# EAGLE design lazurite_ble_cs75 (EAGLE 7.6.0)
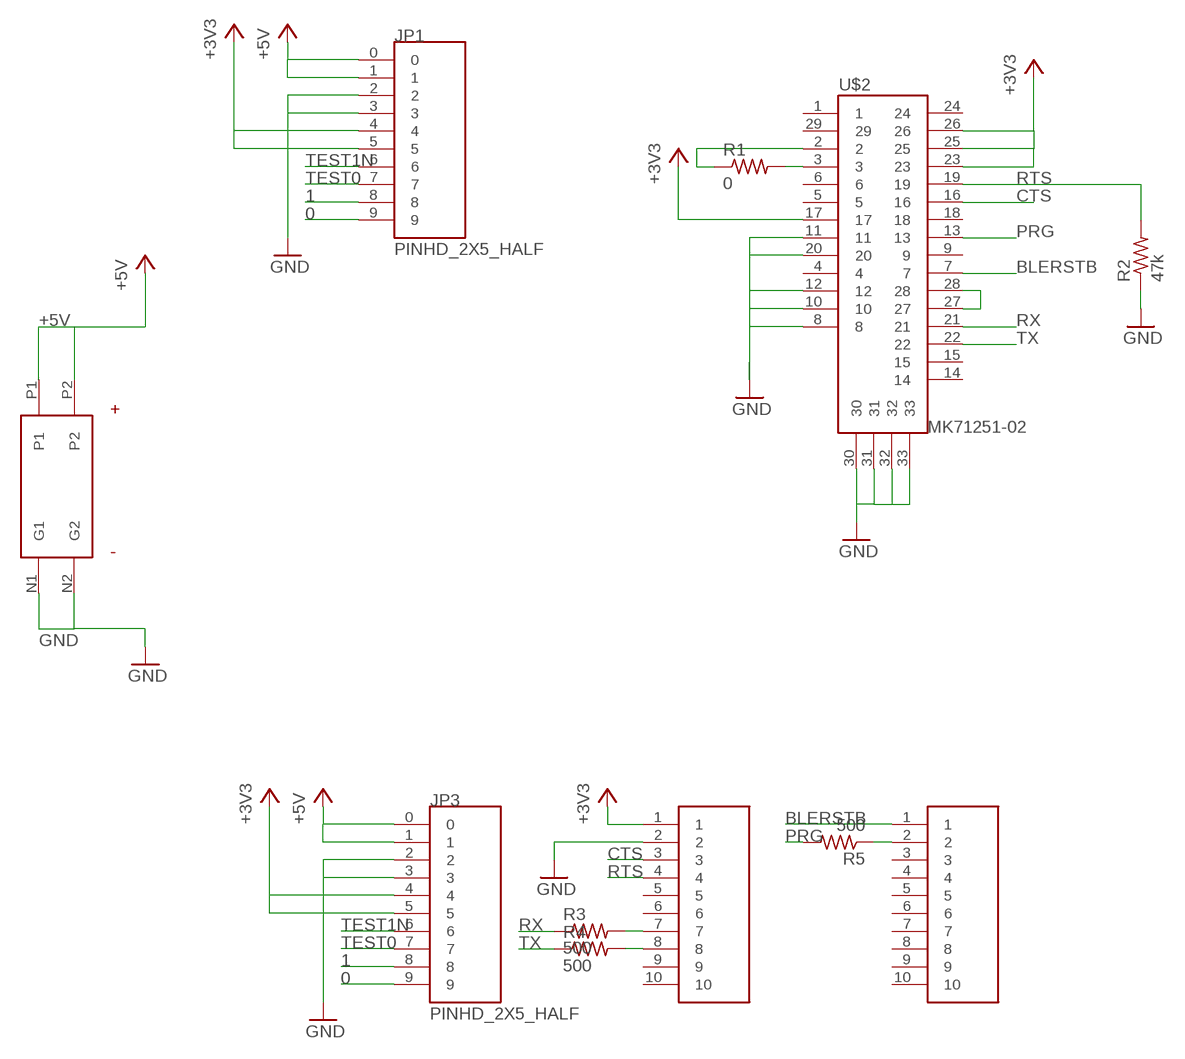
[diagram p0: schematic, sheet 1]

## Parts
JP1  PINHD_2X5_HALF  [PINHD_2X5_HALF]
JP3  PINHD_2X5_HALF  [PINHD_2X5_HALF]
R1  0  R-US_R0402  [R0402]
R2  47k  R-US_R0402  [R0402]
R3  500  R-US_R0402  [R0402]
R4  500  R-US_R0402  [R0402]
R5  500  R-US_R0402  [R0402]
U$1  TAKACHI_CS75_BATTERY  [TAKACHI_CS75_BATTERY]
U$2  MK71251-02  [MK71251-02]
U$3  PINHD_1_10_HALF  [PINHD_1X10_HALF]
U$4  PINHD_1_10_HALF  [PINHD_1X10_HALF]

## Nets
0: JP1.9 JP3.9
1: JP1.8 JP3.8
+3V3: JP1.4 JP1.5 JP3.4 JP3.5 U$2.17 U$2.23 U$2.25 U$2.26 U$3.1
+5V: JP1.0 JP1.1 JP3.0 JP3.1 U$1.P1 U$1.P2
BLERSTB: U$2.7 U$4.1
CTS: U$2.16 U$3.3
GND: JP1.2 JP1.3 JP3.2 JP3.3 R2.1 U$1.N1(G1) U$1.N2(G2) U$2.8 U$2.10 U$2.11 U$2.12 U$2.20 U$2.30 U$2.31 U$2.32 U$2.33 U$3.2
N$1: R1.2 U$2.3
N$2: R1.1 U$2.2
N$4: U$2.27 U$2.28
N$7: R5.1 U$4.2
N$9: R4.2 U$3.8
N$10: R3.2 U$3.7
PRG: R5.2 U$2.13
RTS: R2.2 U$2.19 U$3.4
RX: R3.1 U$2.21
TEST0: JP1.7 JP3.7
TEST1N: JP1.6 JP3.6
TX: R4.1 U$2.22
Unconnected: U$2.1 U$2.4 U$2.5 U$2.6 U$2.9 U$2.14 U$2.15 U$2.18 U$2.24 U$2.29 U$3.5 U$3.6 U$3.9 U$3.10 U$4.3 U$4.4 U$4.5 U$4.6 U$4.7 U$4.8 U$4.9 U$4.10

## Library data of the parts
JP1 JP3 = lazurite:PINHD_2X5_HALF
R1-R5 = rcl:R-US_: RESISTOR, American symbol
U$1 = lz-shield:TAKACHI_CS75_BATTERY
U$2 = lz-shield:MK71251-02
U$3 U$4 = lazurite:PINHD_1_10_HALF

## Board
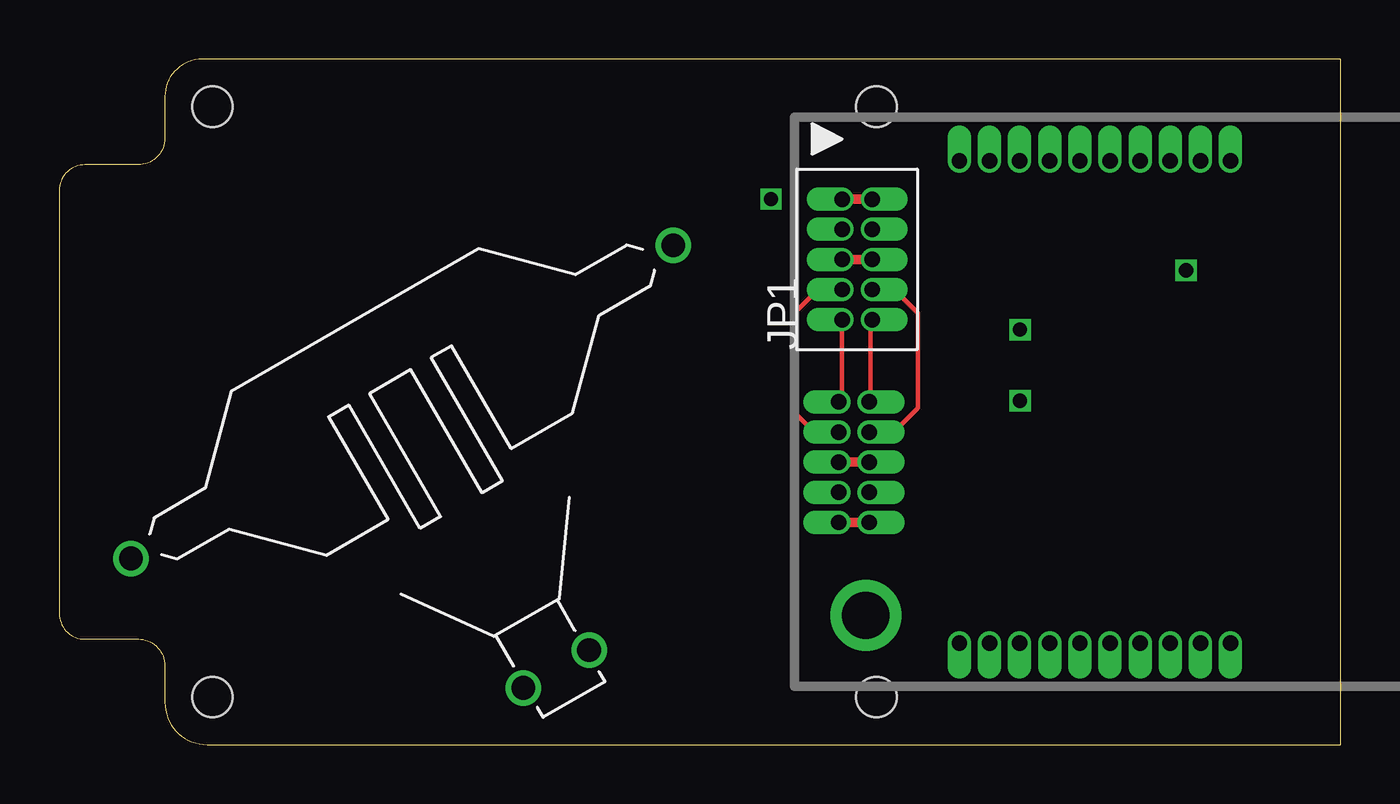
[diagram p1: board, top side]
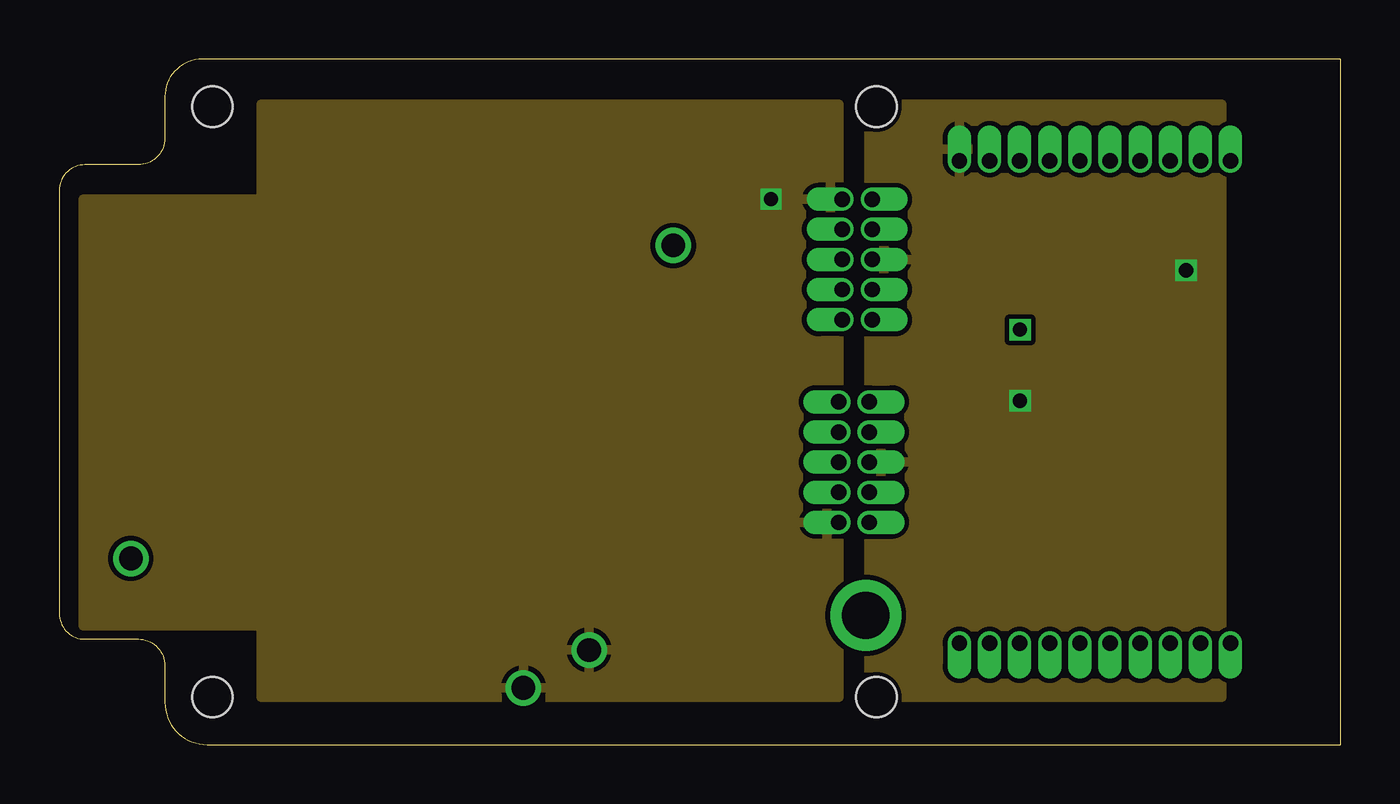
[diagram p2: board, inner layer Route2]
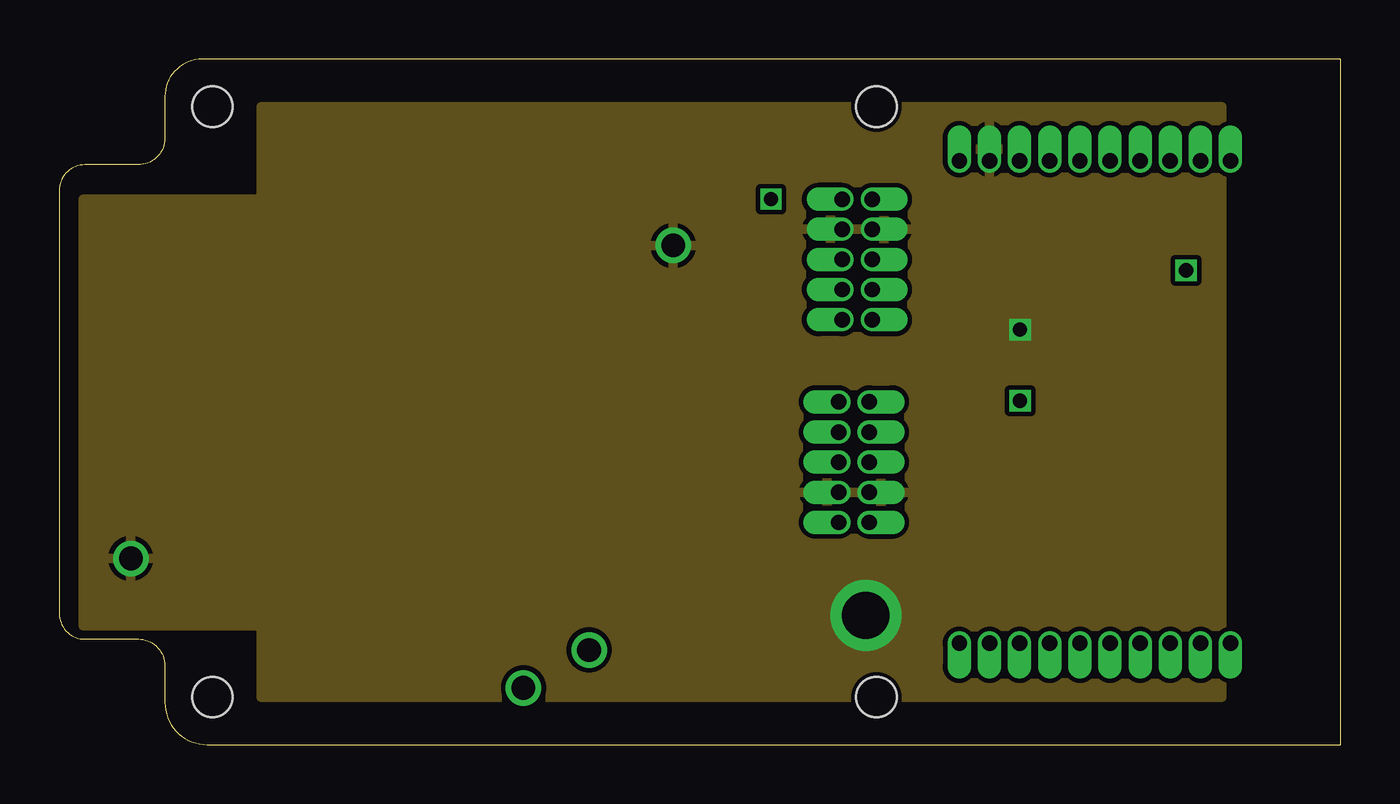
[diagram p3: board, inner layer Route3]
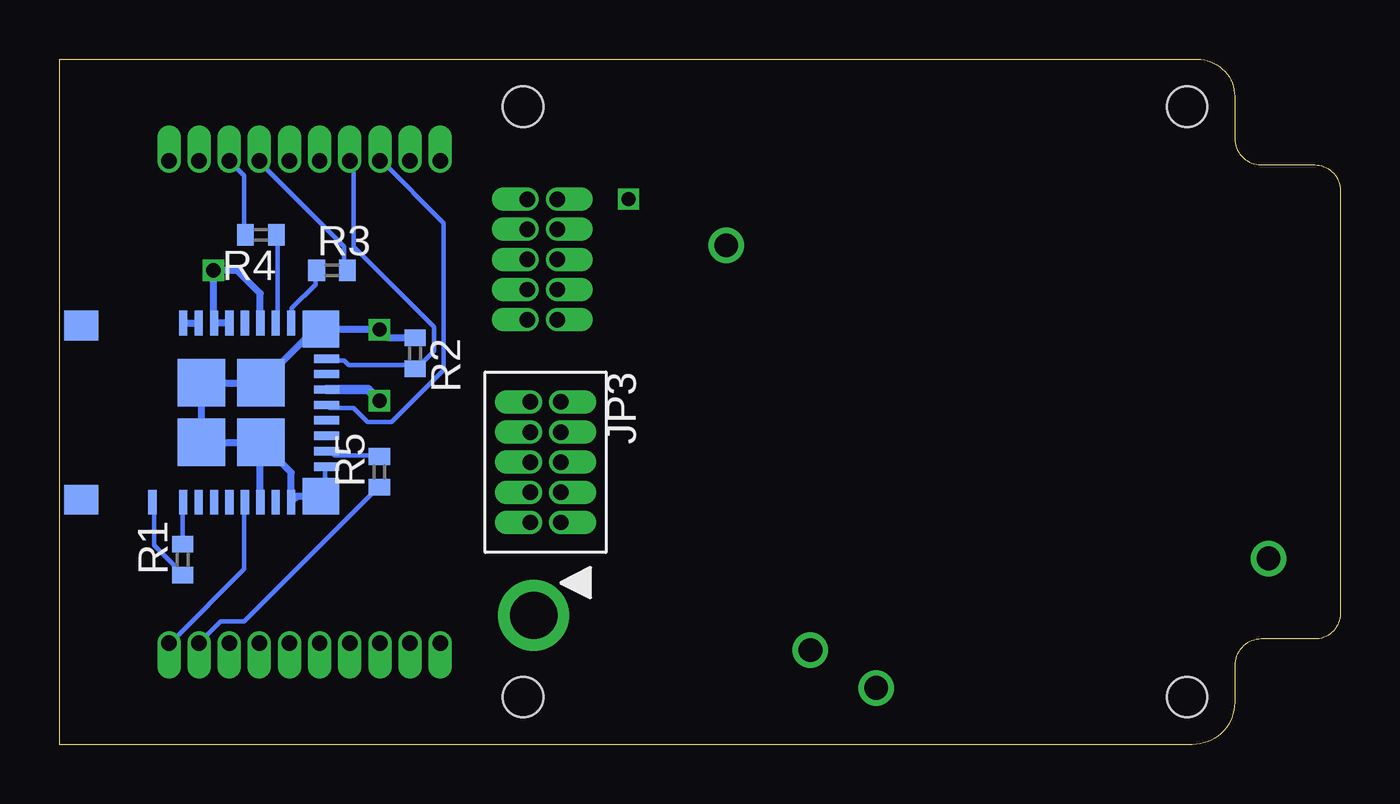
[diagram p4: board, bottom side, seen from below]

Size 54 x 28.9 mm. Coordinates in mm from the lower left corner, seen from the top.
Outline: 4.45,3.33 4.45,1.78 arc90 6.23,0 54,0 54,28.9 6.02,28.9 arc90 4.45,27.33 4.45,25.57 arc-90 3.33,24.45 1.07,24.45 arc90 0,23.38 0,5.52 arc90 1.07,4.45 3.33,4.45 arc-90 4.45,3.33
Copper layers (1+2*3+16): Top 0.018mm / dielectric 0.36mm / Route2 0.035mm / dielectric 0.71mm / Route3 0.035mm / dielectric 0.36mm / Bottom 0.018mm
Design rules "eC_4Layer_PClass6_BaseCopperO18-I35_eCDefault *": minimum track width 0.2mm, minimum drill 0.35mm, track to track 0.2mm, track to pad 0.2mm, pad to pad 0.2mm, via to via 0.2mm, smd to smd 0mil, copper to edge 0.2mm, drill to drill 0.3mm, minimum pad ring 0.175mm, minimum via ring 0.125mm, stop-mask expansion 0mil, vias tented up to drill 0.45mm, thermal gap 0.2mm
Holes 1.7 mm at 34.45,26.9 6.45,26.9 6.45,2 34.45,2

### Footprints (pad centres in the part's own frame; a part is rotated, then mirrored left to right if it is on the bottom)
PINHD_2X5_HALF = drill 0.65 pad 0.813 offset: 0 0,0; 1 0,-1.27; 2 -1.27,0; 3 -1.27,-1.27; 4 -2.54,0; 5 -2.54,-1.27; 6 -3.81,0; 7 -3.81,-1.27; 8 -5.08,0; 9 -5.08,-1.27
R0402 = smd 0.7 x 0.9: 1 -0.65,0; 2 0.65,0
TAKACHI_CS75_BATTERY = drill 1: N1 -13.2,0; N2 13.2,0; P1 -1.6,13; P2 1.6,13
MK71251-02 = smd 1.25 x 1.45: 1 -3.675,5.075; 29 3.675,5.075 | smd 1.05 x 0.35: 2 -3.775,2.075; 3 -3.775,0.775; 4 -3.775,0.125; 5 -3.775,-0.525; 6 -3.775,-1.175; 7 -3.775,-1.825; 8 -3.775,-2.475; 9 -3.775,-3.125; 10 -3.775,-3.775; 21 3.775,-3.775; 22 3.775,-3.125; 23 3.775,-2.475; 24 3.775,-1.825; 25 3.775,-1.175; 26 3.775,-0.525; 27 3.775,0.125; 28 3.775,0.775 | smd 1.55 x 1.55: 11 -3.525,-5.025; 20 3.525,-5.025 | smd 0.35 x 1.05: 12 -2.275,-5.275; 13 -1.625,-5.275; 14 -0.975,-5.275; 15 -0.325,-5.275; 16 0.325,-5.275; 17 0.975,-5.275; 18 1.625,-5.275; 19 2.275,-5.275 | smd 2 x 2: 30 -1.25,0; 31 -1.25,-2.5; 32 1.25,-2.5; 33 1.25,0
PINHD_1X10_HALF = drill 0.65 pad 0.8 offset: 1 0,0; 2 1.27,0; 3 2.54,0; 4 3.81,0; 5 5.08,0; 6 6.35,0; 7 7.62,0; 8 8.89,0; 9 10.16,0; 10 11.43,0

### Placement (x,y rotation side)
JP1  33,23 90 top
JP3  32.87,9.37 270 bottom
R1  48.8,7.8 90 bottom
R2  39,16.5 270 bottom
R3  42.5,20 0 bottom
R4  45.5,21.5 180 bottom
R5  40.5,11.5 90 bottom
U$1  14.45,14.45 210 top
U$2  48,14 90 bottom
U$3  37.95,24.61 180 bottom
U$4  49.38,4.29 0 bottom

### Tracks (layer width: path | path; a pad name or v marks a point on that pad's centre or on a via)
0
  Top 0.2: JP3.9 34.2,14.6 34.2,17.8 JP1.9
1
  Top 0.2: JP1.8 33,14.6 JP3.8
+3V3  (via drill 0.6)
  Top 0.406: JP1.4 JP1.5 | JP3.4 JP3.5
  Bottom 0.305: 47.42,17.85 U$2.26 | 45.52,18.23 U$2.23 45.52,19.02 46.5,20 v47.5,20 | 47.42,19.93 v47.5,20 | U$2.26 47.5,17.77 v47.5,20 | U$2.25 U$2.26
  Bottom 0.406: U$2.17 40.98,14.97 v40.5,14.5
  pour Route2: 34.14,27 34.14,2 49,2 49,27
+5V  (via drill 0.6)
  Top 0.406: JP1.1 JP1.0 | JP3.0 JP3.1
  other vias: 30,23
  pour Route2: 1,23 1,5 8.5,5 8.5,2 32.87,2 32.87,27 8.5,27 8.5,23
BLERSTB
  Bottom 0.2: U$2.7 46.2,10.2 46.2,7.4 49.2,4.4 U$4.1
CTS
  Bottom 0.2: U$2.16 42.6,14.2 41.6,14.2 41,13.6 40,13.6 37.8,15.8 37.8,22 40.4,24.6 U$3.3
GND  (via drill 0.6, 2 pad 2.2)
  Bottom 0.2: U$2.12 42.8,11.6 42.8,10.6 U$2.11
  Bottom 0.305: U$2.8 45.52,12.72 | 45.52,12.72 U$2.31 44.23,11.47 U$2.10 43.98,10.47 U$2.11 | 45.52,12.72 47.98,12.72 U$2.30 U$2.33 U$2.32 43.23,17.52 U$2.20 42.95,17.5 v40.5,17.5 40.15,17.15 R2.1
  other vias: 34,5.45
  pour Route3: 1,23 8.5,23 8.5,26.9 49,26.9 49,2 8.5,2 8.5,5 1,5
N$1
  Bottom 0.2: R1.2 48.8,10.2 U$2.3
  Bottom 0.305: 48.83,8.57 R1.2
N$2
  Bottom 0.2: R1.1 48.8,7.2 50,8.4 50,10.2 U$2.2
N$4
  Bottom 0.305: U$2.28 U$2.27
N$7
  Bottom 0.2: R5.1 40.6,10.8 46.2,5.2 47.2,5.2 48,4.4 U$4.2
N$9
  Bottom 0.2: R4.2 46.2,21.6 46.2,24 46.8,24.6 U$3.8
N$10
  Bottom 0.2: R3.2 42,20 42,21 45.6,24.6 U$3.7
PRG
  Bottom 0.2: R5.2 40.6,12.2 42.4,12.2 42.6,12.4 U$2.13
RTS
  Bottom 0.2: U$2.19 42.6,16.2 42,16.2 41.8,16 39,16 R2.2 39,15.8 38.2,16.6 38.2,17.6 41.6,21 41.6,24.6 U$3.4
RX
  Bottom 0.2: R3.1 43.2,20 43.2,19.4 44.2,18.4 44.2,17.8 U$2.21
TEST0
  Top 0.2: JP3.7 34.2,13.2 35.2,13.2 36.2,14.2 36.2,18.2 35.4,19 34.4,19 JP1.7
TEST1N
  Top 0.2: JP3.6 32.8,13.2 31.8,13.2 31,14 31,18.2 31.8,19 33,19 JP1.6
TX
  Bottom 0.2: R4.1 44.8,21.4 44.8,17.8 U$2.22